# Altium schematic sheet X1000_BB.SchDoc
size A
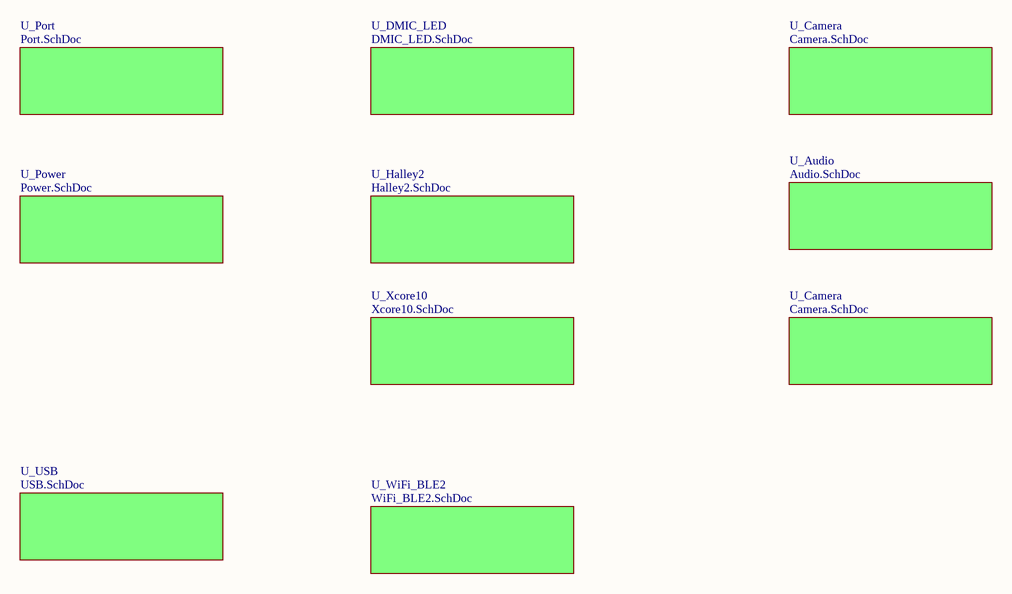
[diagram p0: X1000_BB.SchDoc]

## Sub-sheets
U_Audio = Audio.SchDoc: no entries
U_Camera = Camera.SchDoc: no entries
U_Camera = Camera.SchDoc: no entries
U_DMIC_LED = DMIC_LED.SchDoc: no entries
U_Halley2 = Halley2.SchDoc: no entries
U_Port = Port.SchDoc: no entries
U_Power = Power.SchDoc: no entries
U_USB = USB.SchDoc: no entries
U_WiFi_BLE2 = WiFi_BLE2.SchDoc: no entries
U_Xcore10 = Xcore10.SchDoc: no entries